# EasyEDA Pro project Knight_Rider.eprj

# Schematic Schematic1
Board Name: Board1; Create Date: 2026-06-02; Page Name: P1; Project Name: Knight_Rider; Schematic Name: Schematic1; Update Date: 2026-06-06; Company: EasyEDA.com; Page Size: A4; Version: V1.0
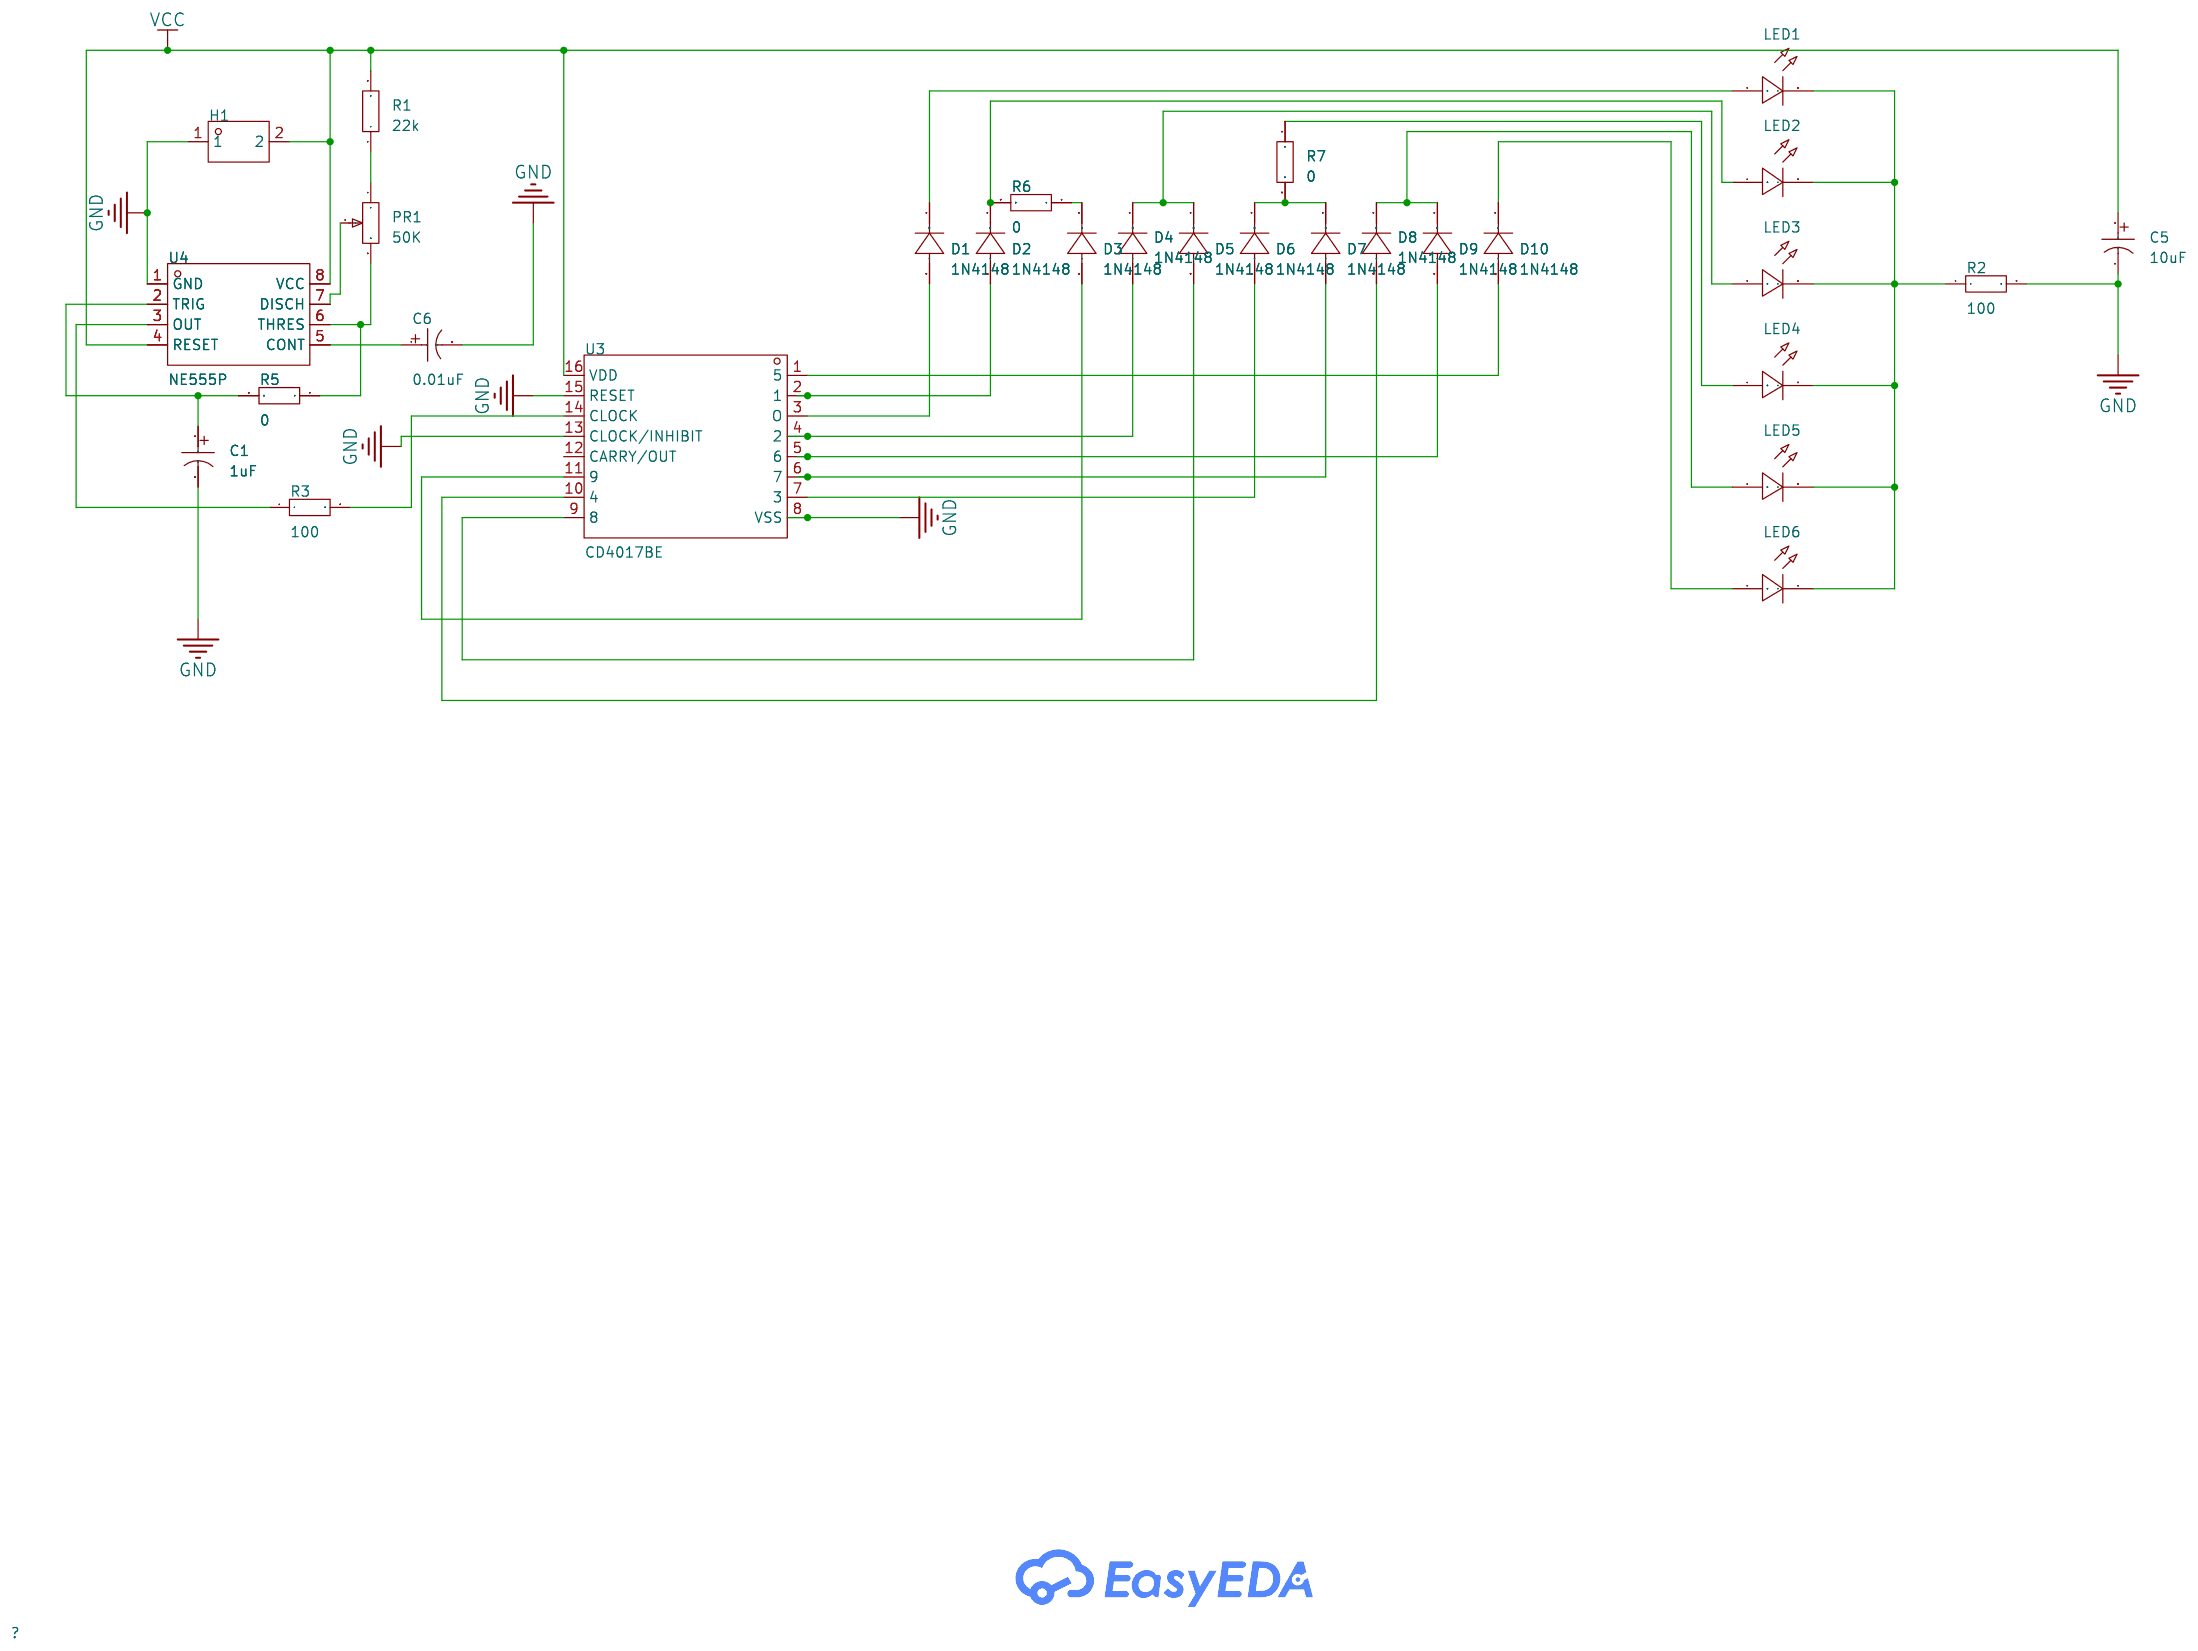
[diagram p0: schematic sheet]

## Parts
C1  1uF  [CAP-TH_BD6.3-P2.50-D1.0-FD]
C5  10uF  [CAP-TH_BD6.3-P2.50-D1.0-FD]
C6  0.01uF  [CAP-TH_BD6.3-P2.50-D1.0-FD]
D1  1N4148  [DO-35_BD1.7-L3.6-P10.00-D0.5-RD]
D2  1N4148  [DO-35_BD1.7-L3.6-P10.00-D0.5-RD]
D3  1N4148  [DO-35_BD1.7-L3.6-P10.00-D0.5-RD]
D4  1N4148  [DO-35_BD1.7-L3.6-P10.00-D0.5-RD]
D5  1N4148  [DO-35_BD1.7-L3.6-P10.00-D0.5-RD]
D6  1N4148  [DO-35_BD1.7-L3.6-P10.00-D0.5-RD]
D7  1N4148  [DO-35_BD1.7-L3.6-P10.00-D0.5-RD]
D8  1N4148  [DO-35_BD1.7-L3.6-P10.00-D0.5-RD]
D9  1N4148  [DO-35_BD1.7-L3.6-P10.00-D0.5-RD]
D10  1N4148  [DO-35_BD1.7-L3.6-P10.00-D0.5-RD]
H1  -  [HDR-TH_2P-P2.54-V-M-2]
LED1  -  [LED-TH_BD3.0-P2.54-FD]
LED2  -  [LED-TH_BD3.0-P2.54-FD]
LED3  -  [LED-TH_BD3.0-P2.54-FD]
LED4  -  [LED-TH_BD3.0-P2.54-FD]
LED5  -  [LED-TH_BD3.0-P2.54-FD]
LED6  -  [LED-TH_BD3.0-P2.54-FD]
PR1  50K  [RES-ADJ-TH_3P-L9.5-W9.5-P2.54-BR-BS]
R1  22k  [RES-TH_BD1.8-L3.2-P7.20-D0.4]
R2  100  [RES-TH_BD1.8-L3.2-P7.20-D0.4]
R3  100  [RES-TH_BD1.8-L3.2-P7.20-D0.4]
R5  0  [RES-TH_BD1.8-L3.2-P7.20-D0.4]
R6  0  [RES-TH_BD1.8-L3.2-P7.20-D0.4]
R7  0  [RES-TH_BD1.8-L3.2-P7.20-D0.4]
U3  CD4017BE  [DIP-16_16P-L20.2-W6.6-P2.54-LS7.6-BL]
U4  NE555P  [DIP-8_L9.8-W6.6-P2.54-LS7.6-BL]

## Library data of the parts
C1 C5 C6 = KS227M016E07RR0VH2FP0: LCSC Part Name: 220uF ±20% 16V; Supplier Part: C43340; Manufacturer: Chengx(承兴); Supplier Footprint: 插件,D6.3xL7mm; JLCPCB Part Class: Extended Part; Datasheet: https://item.szlcsc.com/datasheet/KS227M016E07RR0VH2FP0/44331.html; Supplier: LCSC; Tolerance: ±20%; Voltage Rating: 16V; Pin Spacing: 2.5mm; Diameter: 6.3mm; Height - Seated (Max): 7mm; Lifetime: 1000hrs@105℃; Operating Temperature: -40℃~+105℃
D1-D10 = 1N4148_C22434654: Supplier Part: C22434654; Manufacturer: DIOTEC(德欧泰克); Supplier Footprint: DO-35; JLCPCB Part Class: Extended Part; Datasheet: https://item.szlcsc.com/datasheet/1N4148/24058303.html; Supplier: LCSC; Pd - Power Dissipation: 500mW; Current - Rectified: 200mA; Voltage - DC Reverse(Vr): 75V; Voltage - Forward(Vf@If): 1V@10mA; Reverse Leakage Current (Ir): 5uA@75V; Operating Junction Temperature Range: -50℃~+175℃
H1 = HDR-M_2.54_2x1: Supplier Footprint: Through
LED1-LED6 = LED_TH-R_3mm: Supplier Footprint: Through
PR1 = R_3386P: Supplier Footprint: Through
R1-R3 R5-R7 = Res_AXIAL-1/8W: Supplier Footprint: Through
U3 = CD4017BE_C34519: LCSC Part Name: 5.5MHz 10位十进制计数器; Supplier Part: C34519; Manufacturer: TI(德州仪器); Supplier Footprint: DIP-16; JLCPCB Part Class: Extended Part; Datasheet: https://www.ti.com/cn/lit/gpn/cd4017b; Supplier: LCSC; Logic Type: Divide-by-10; Direction: Up Counter; Voltage - Supply: 3V~18V; Number of Elements: 1; Trigger Type: Rising Edge; Reset: Asynchronous; Timing: Synchronous; Count Rate: 5.5MHz; Operating Temperature: -55℃~+125℃; Propagation Delay: 135ns; Features: Reset function；Cascade counter；Static operation
U4 = NE555P: LCSC Part Name: 555精密定时器; Supplier Part: C46749; Manufacturer: TI(德州仪器); Supplier Footprint: DIP-8; JLCPCB Part Class: Extended Part; Datasheet: https://www.ti.com/cn/lit/gpn/ne555; Supplier: LCSC; Timer Number: 1; Voltage - Supply: 4.5V~16V; Output Current: 200mA; Supply Current: 2mA; Operating Temperature: 0℃~+70℃; Features: 占空比可调振荡；复位功能

## Nets
GND: C1.2 C5.2 C6.2 H1.1 R2.2 U3.8(VSS) U3.13(CLOCK/INHIBIT) U3.15(RESET) U4.1(GND)
VCC: C5.1 H1.2 R1.2 U3.16(VDD) U4.4(RESET) U4.8(VCC)
$1N2038: D1.2(A) U3.3(O)
$1N2046: D2.2(A) U3.2(1)
$1N2052: D3.2(A) U3.11(9)
$1N2063: D4.2(A) U3.4(2)
$1N2071: D5.2(A) U3.9(8)
$1N2086: D6.2(A) U3.7(3)
$1N2096: D8.2(A) U3.10(4)
$1N2109: D9.2(A) U3.5(6)
$1N2117: D10.2(A) U3.1(5)
$1N2219: D8.1(C) D9.1(C) LED5.1(C)
$1N2258: D10.1(C) LED6.1(C)
$1N2754: LED1.2(A) LED2.2(A) LED3.2(A) LED4.2(A) LED5.2(A) LED6.2(A) R2.1
$1N3011: C6.1 U4.5(CONT)
$1N3091: PR1.1 R1.1
$1N3125: PR1.2 U4.7(DISCH)
$1N3131: R3.1 U4.3(OUT)
$1N3149: R3.2 U3.14(CLOCK)
$1N3745: D1.1(C) LED1.1(C)
$1N4406: D7.2(A) U3.6(7)
$1N4518: C1.1 R5.2 U4.2(TRIG)
$1N4603: PR1.3 R5.1 U4.6(THRES)
$1N4871: D3.1(C) R6.1
$1N4876: D2.1(C) LED2.1(C) R6.2
$1N4926: D4.1(C) D5.1(C) LED3.1(C)
$1N4944: LED4.1(C) R7.1
$1N4948: D6.1(C) D7.1(C) R7.2

Not connected (* = marked no-connect by the designer): U3 12(CARRY/OUT)

# Board PCB1
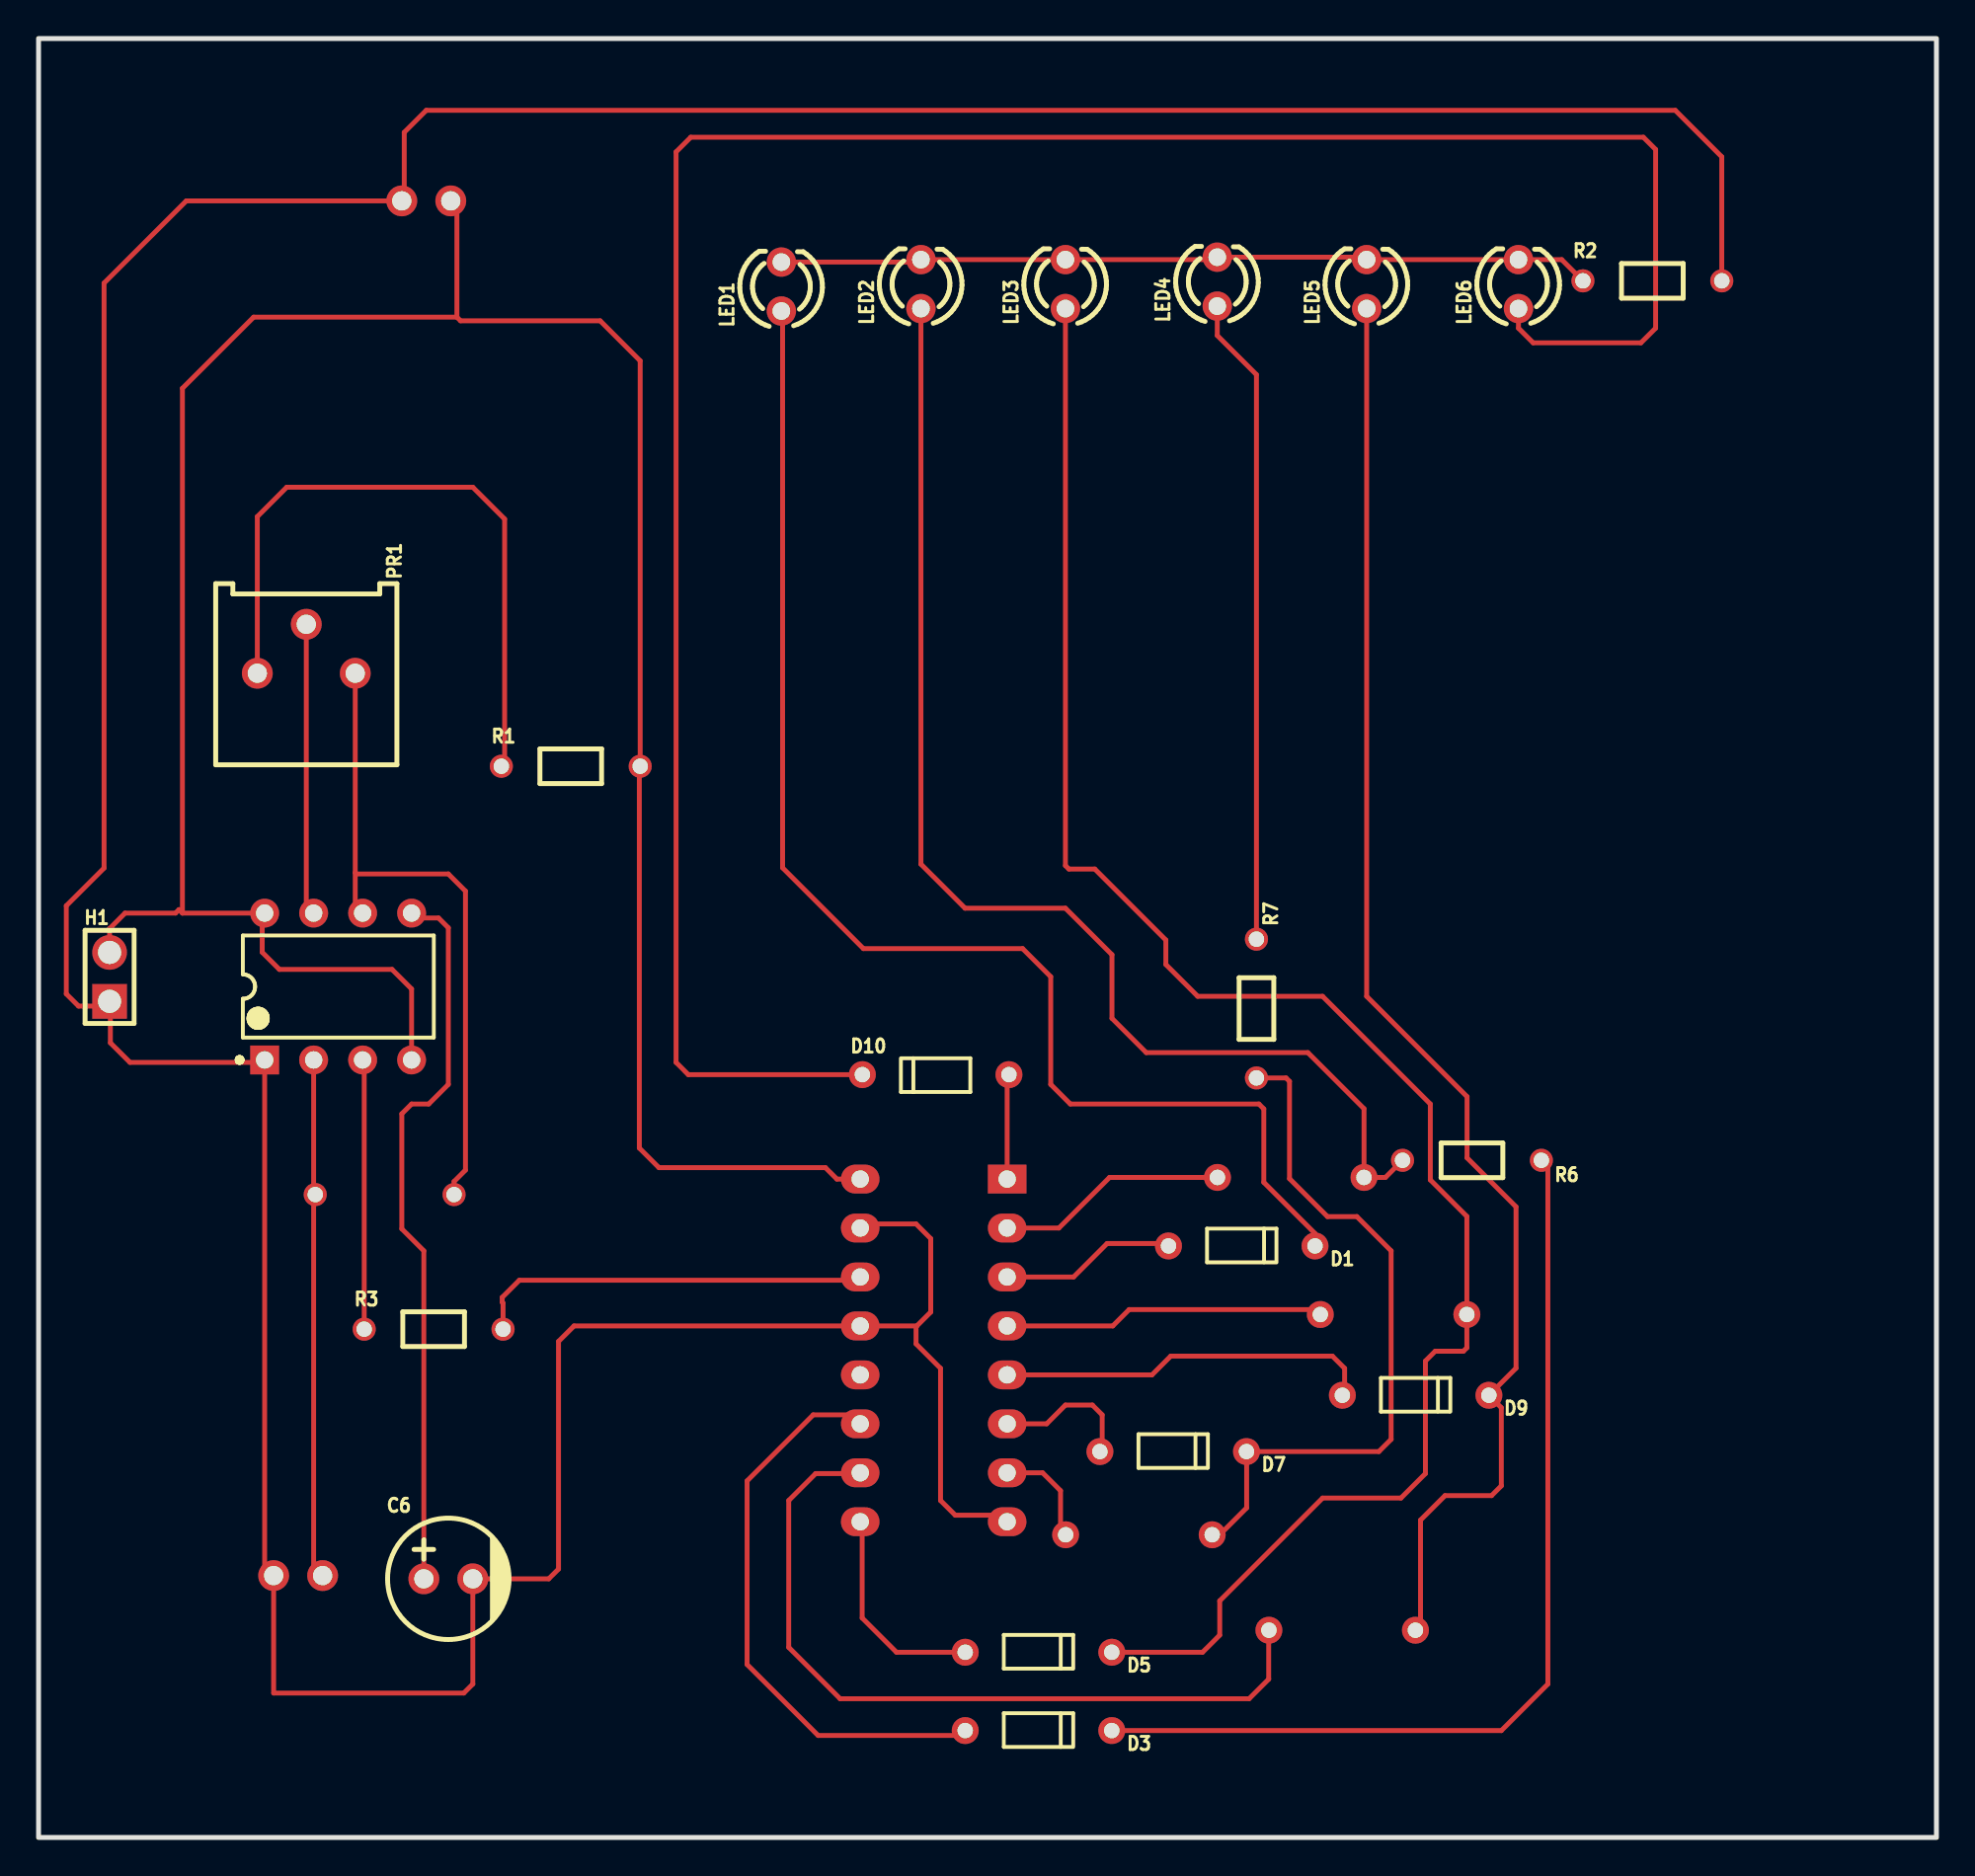
[diagram p1: board, top side]
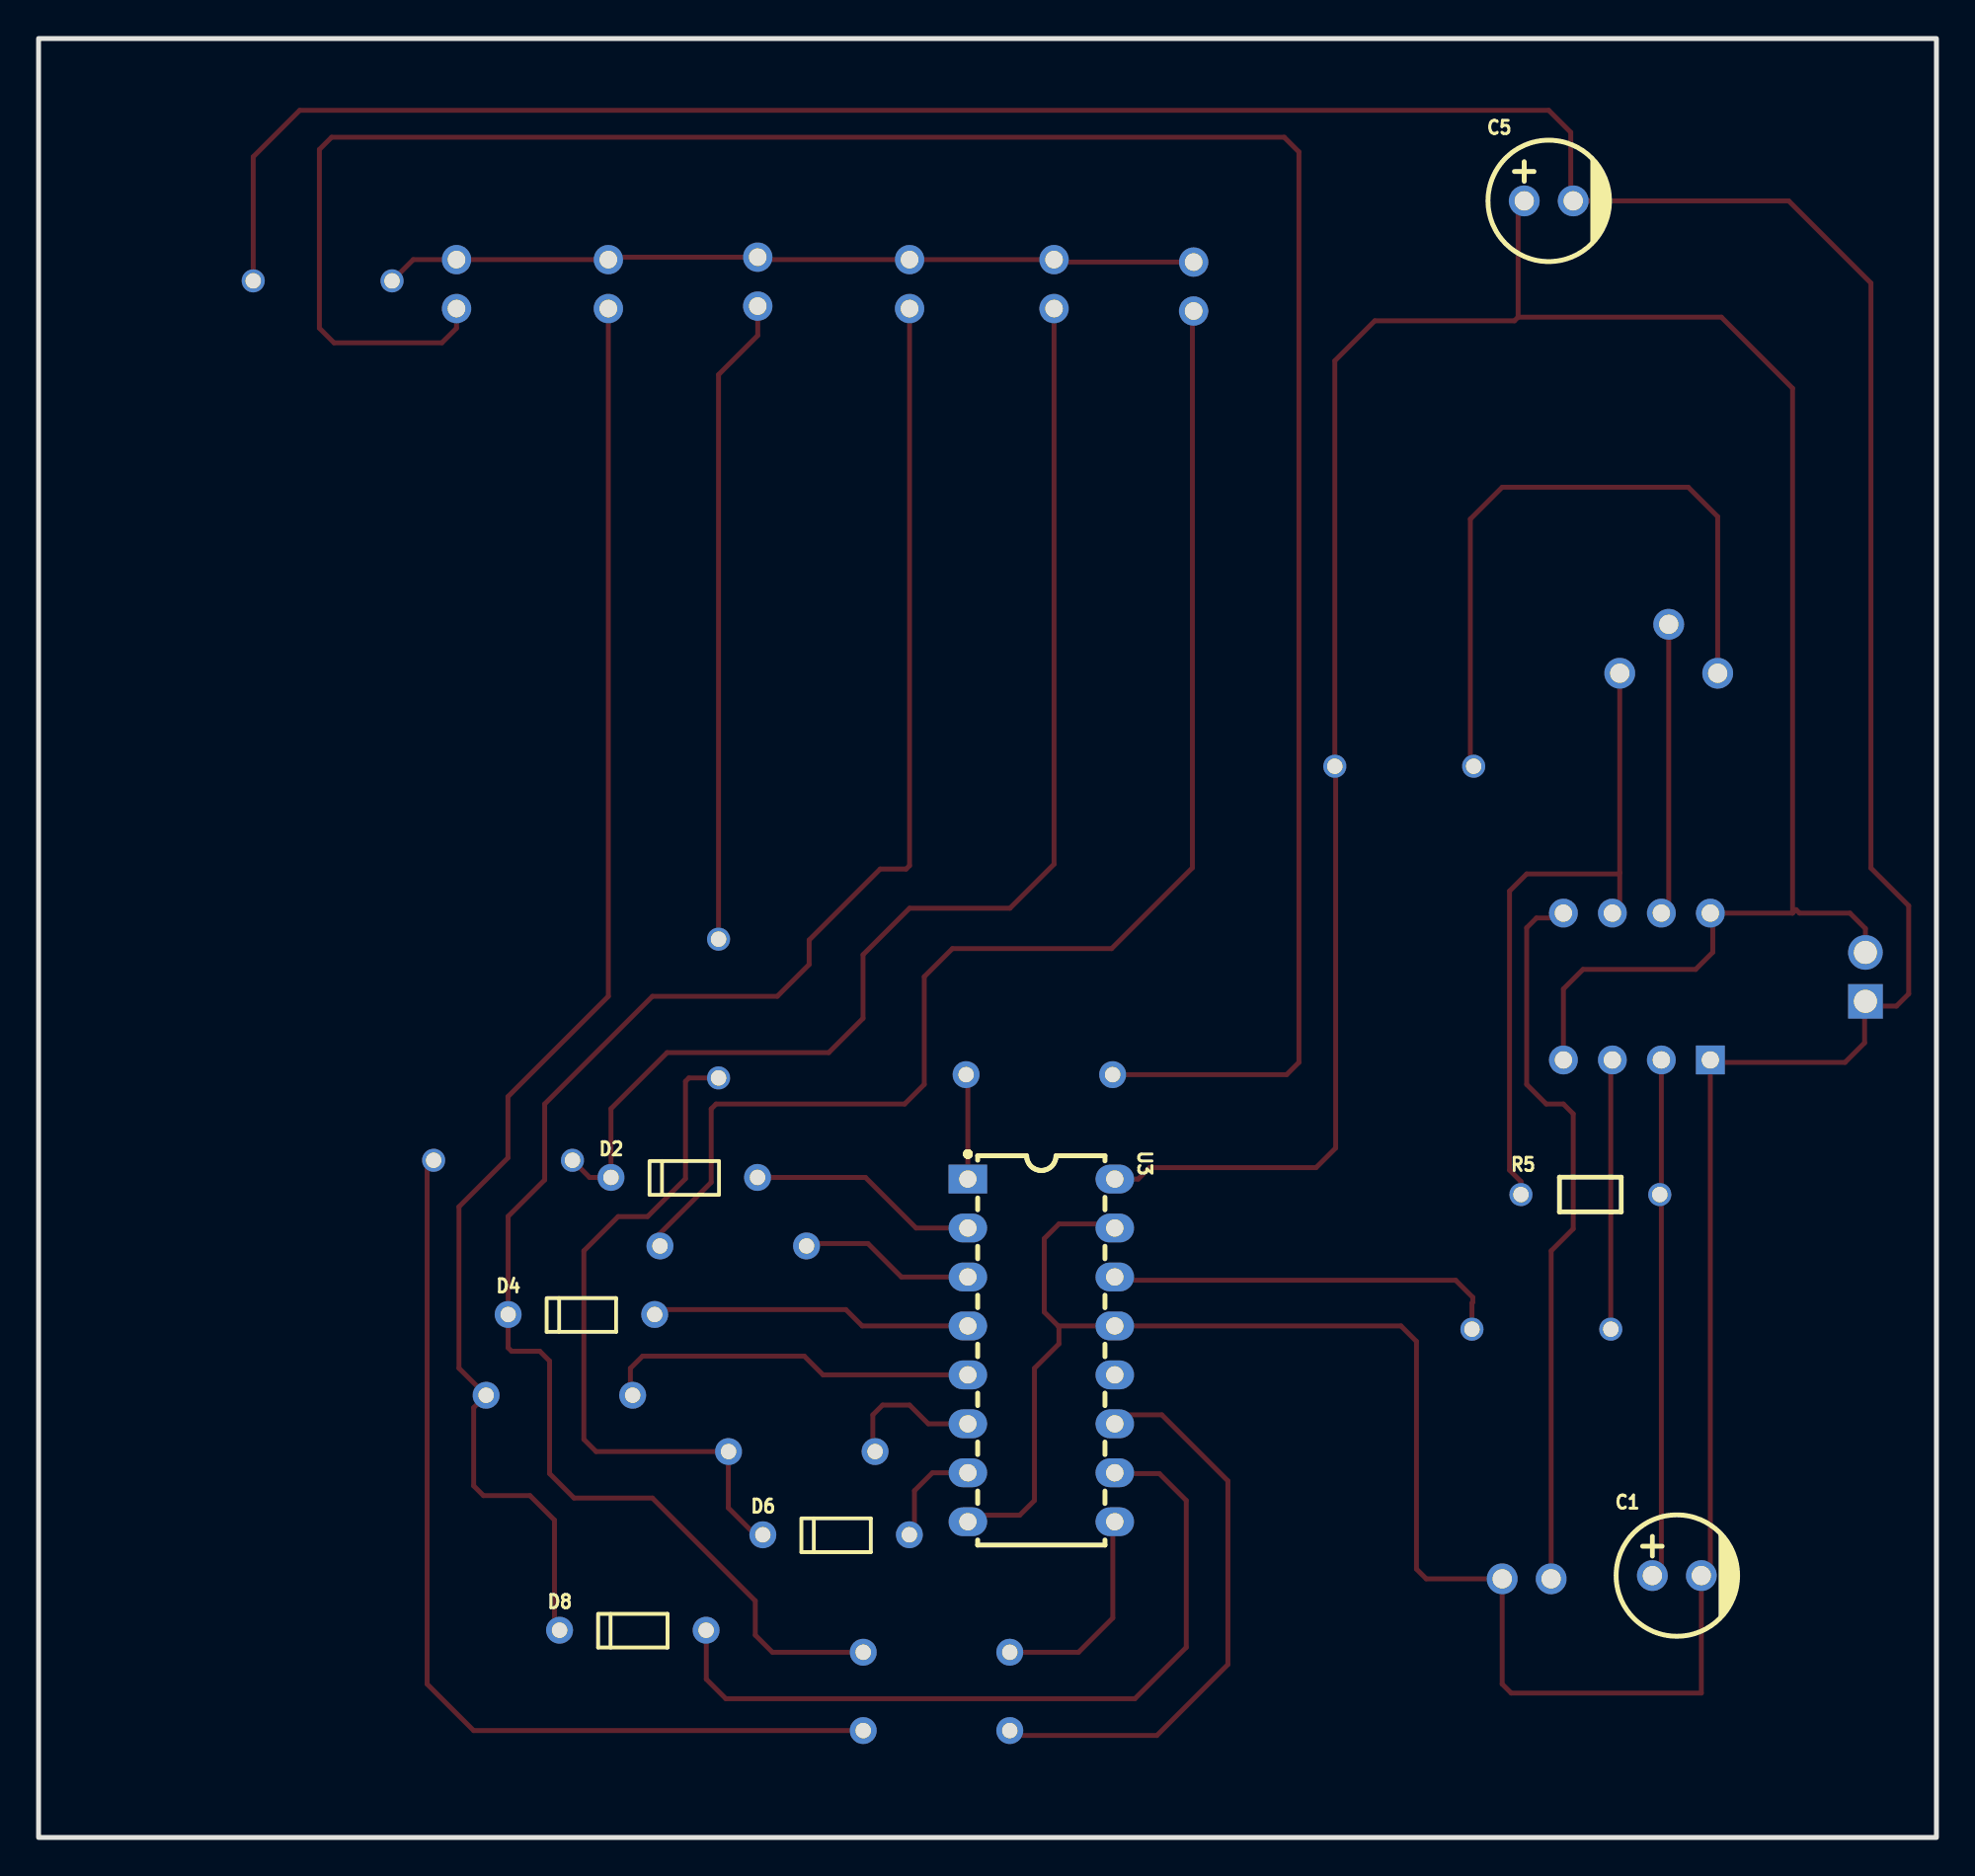
[diagram p2: board, bottom side, seen from below]

Outline 98.42 x 93.35 mm; copper layers: Top Layer, Bottom Layer. Coordinates in mm from the lower left corner of the outline.
Outline path: rectangle 0,93.35 98.42,0
Stack: Top Layer 0.035mm / Dielectric1 1.51mm FR4 er 4.5 / Bottom Layer 0.035mm

## Design rules (mm)
template: JLCPCB Capability(Two Layers Board)
spacing copperThickness1oz (default): track to track 0.102, other pairs 0.152 to 0.3
spacing copperThickness2oz: track to track 0.203, other pairs 0.152 to 0.3
track width copperThickness1oz (default): min 0.127, default 0.254, max 2.54
track width copperThickness2oz: min 0.203, default 0.254, max 2.54
differential pair differentialPair (default): width min 0.127, default 0.254, max 2.54; gap min 0.152, default 0.152
via viaSize (default): diameter min 0.5, default 0.61, max 10; hole min 0.3, default 0.305, max 6.3

## Placement (name value [footprint] x y rotation side)
C1  1uF  [CAP-TH_BD6.3-P2.50-D1.0-FD]  13.46 13.59 180 bottom
C5  10uF  [CAP-TH_BD6.3-P2.50-D1.0-FD]  20.11 84.92 180 bottom
C6  0.01uF  [CAP-TH_BD6.3-P2.50-D1.0-FD]  21.25 13.42 0 top
D1  1N4148  [DO-35_BD1.7-L3.6-P10.00-D0.5-RD]  62.4 30.69 180 top
D2  1N4148  [DO-35_BD1.7-L3.6-P10.00-D0.5-RD]  64.94 34.25 180 bottom
D3  1N4148  [DO-35_BD1.7-L3.6-P10.00-D0.5-RD]  51.86 5.55 180 top
D4  1N4148  [DO-35_BD1.7-L3.6-P10.00-D0.5-RD]  70.27 27.14 180 bottom
D5  1N4148  [DO-35_BD1.7-L3.6-P10.00-D0.5-RD]  51.86 9.61 180 top
D6  1N4148  [DO-35_BD1.7-L3.6-P10.00-D0.5-RD]  57.06 15.71 180 bottom
D7  1N4148  [DO-35_BD1.7-L3.6-P10.00-D0.5-RD]  58.84 20.02 180 top
D8  1N4148  [DO-35_BD1.7-L3.6-P10.00-D0.5-RD]  67.61 10.75 180 bottom
D9  1N4148  [DO-35_BD1.7-L3.6-P10.00-D0.5-RD]  71.42 22.95 180 top
D10  1N4148  [DO-35_BD1.7-L3.6-P10.00-D0.5-RD]  46.52 39.58 0 top
H1  -  [HDR-TH_2P-P2.54-V-M-2]  3.68 44.66 0 top
LED1  -  [LED-TH_BD3.0-P2.54-FD]  38.52 80.48 90 top
LED2  -  [LED-TH_BD3.0-P2.54-FD]  45.76 80.6 90 top
LED3  -  [LED-TH_BD3.0-P2.54-FD]  53.25 80.6 90 top
LED4  -  [LED-TH_BD3.0-P2.54-FD]  61.13 80.73 90 top
LED5  -  [LED-TH_BD3.0-P2.54-FD]  68.88 80.6 90 top
LED6  -  [LED-TH_BD3.0-P2.54-FD]  76.75 80.6 90 top
PR1  50K  [RES-ADJ-TH_3P-L9.5-W9.5-P2.54-BR-BS]  13.88 61.68 270 top
R1  22k  [RES-TH_BD1.8-L3.2-P7.20-D0.4]  27.6 55.58 0 top
R2  100  [RES-TH_BD1.8-L3.2-P7.20-D0.4]  83.69 80.77 0 top
R3  100  [RES-TH_BD1.8-L3.2-P7.20-D0.4]  20.49 26.37 0 top
R5  0  [RES-TH_BD1.8-L3.2-P7.20-D0.4]  17.95 33.36 180 bottom
R6  0  [RES-TH_BD1.8-L3.2-P7.20-D0.4]  74.34 35.14 180 top
R7  0  [RES-TH_BD1.8-L3.2-P7.20-D0.4]  63.16 43.01 270 top
U3  CD4017BE  [DIP-16_16P-L20.2-W6.6-P2.54-LS7.6-BL]  46.42 25.27 270 bottom
U4  NE555P  [DIP-8_L9.8-W6.6-P2.54-LS7.6-BL]  15.54 44.15 0 top

## Footprints (pads in the part's own frame, mm; a bottom-side part is the same pattern mirrored in y, then rotated)
CAP-TH_BD6.3-P2.50-D1.0-FD
  round 1.6 hole 1: 1(-1.27,0) 2(1.27,0)
DIP-8_L9.8-W6.6-P2.54-LS7.6-BL
  rect 1.5x1.5 hole 0.9: 1(-3.81,-3.81)
  round 1.5 hole 0.9: 2(-1.27,-3.81) 3(1.27,-3.81) 4(3.81,-3.81) 5(3.81,3.81) 6(1.27,3.81) 7(-1.27,3.81) 8(-3.81,3.81)
DIP-16_16P-L20.2-W6.6-P2.54-LS7.6-BL
  rect 1.5x2 hole 0.9: 1(-8.89,-3.81)
  oval 1.5x2 hole 0.9: 2(-6.35,-3.81) 3(-3.81,-3.81) 4(-1.27,-3.81) 5(1.27,-3.81) 6(3.81,-3.81) 7(6.35,-3.81) 8(8.89,-3.81) 9(8.89,3.81) 10(6.35,3.81) 11(3.81,3.81) 12(1.27,3.81) 13(-1.27,3.81) 14(-3.81,3.81) 15(-6.35,3.81) 16(-8.89,3.81)
DO-35_BD1.7-L3.6-P10.00-D0.5-RD
  round 1.4 hole 0.8: 1(-3.8,0) 2(3.8,0)
HDR-TH_2P-P2.54-V-M-2
  rect 1.8x1.8 hole 1.2: 1(0,-1.27)
  round 1.8 hole 1.2: 2(0,1.27)
LED-TH_BD3.0-P2.54-FD
  round 1.524 hole 0.914: 1(-1.27,0) 2(1.27,0)
RES-ADJ-TH_3P-L9.5-W9.5-P2.54-BR-BS
  round 1.6 hole 1: 1(1.27,-2.54) 2(-1.27,0) 3(1.27,2.54)
RES-TH_BD1.8-L3.2-P7.20-D0.4
  round 1.2 hole 0.8: 1(-3.6,0) 2(3.6,0)

## Nets
As in the schematic.

Pads without a net: U3 12

## Routing (per net, layer and track width the routed paths; a pad name or vN(x,y) marks a point on that pad's centre or on a via; arc(x,y) is an arc through that point)
GND: length 254.8
  Top Layer w0.254: 45.55,26.54 45.51,26.5 45.51,25.61 46.78,24.34 46.78,17.48 47.54,16.72 49.89,16.72 U3.8 ; 45.55,26.54 46.27,27.26 46.27,31.07 45.51,31.84 42.82,31.84 U3.15 ; 45.55,26.54 U3.13 27.77,26.54 26.97,25.74 26.97,13.93 26.46,13.42 C6.2 22.52,7.96 22.05,7.49 12.19,7.49 C1.2 11.73,14.06 U4.1 11.6,40.22 4.74,40.22 3.72,41.23 3.72,43.34 H1.1 3.44,43.14 2.07,43.14 1.44,43.77 1.44,48.35 3.4,50.3 3.4,80.66 7.66,84.92 C5.2 18.96,85.05 18.96,88.48 20.11,89.62 84.88,89.62 ; R2.2 87.29,87.21 84.88,89.62
VCC: length 136.7
  Top Layer w0.254: 21.7,78.89 21.7,84.6 C5.1 ; 21.7,78.89 11.15,78.89 7.46,75.2 7.46,47.96 ; 21.7,78.89 21.89,78.7 29.12,78.7 31.2,76.62 R1.2 31.16,55.54 31.16,35.77 32.17,34.76 40.81,34.76 41.4,34.16 U3.16 ; 7.46,47.96 U4.8 11.6,47.84 11.6,45.93 12.49,45.04 18.33,45.04 19.35,44.03 U4.4 ; 7.46,47.96 7.28,48.14 7.1,47.96 4.49,47.96 3.68,47.16 H1.2
$1N2038: length 9.1
  Top Layer w0.254: D1.2 58.47,30.82 55.41,30.82 53.68,29.08 U3.3
$1N2046: length 12
  Top Layer w0.254: U3.2 52.92,31.62 55.54,34.25 D2.2
$1N2052: length 29.9
  Top Layer w0.254: D3.2 47.8,5.29 40.43,5.29 36.74,8.98 36.74,18.5 40.17,21.93 42.14,21.93 U3.11
$1N2063: length 16.7
  Top Layer w0.254: U3.4 55.71,26.54 56.56,27.39 66.22,27.39 D4.2
$1N2071: length 11.1
  Top Layer w0.254: D5.2 44.49,9.61 42.71,11.39 42.71,16.28 U3.9
$1N2086: length 5.5
  Top Layer w0.254: D6.2 53,15.97 53,17.99 52.07,18.92 U3.7
$1N2096: length 40.9
  Top Layer w0.254: U3.10 42.57,18.88 40.3,18.88 38.9,17.48 38.9,9.86 41.57,7.2 62.78,7.2 63.8,8.21 63.8,10.74 D8.2
$1N2109: length 19.6
  Top Layer w0.254: U3.5 57.74,24 58.72,24.98 67.1,24.98 67.73,24.34 67.73,23.06 D9.2
$1N2117: length 5.5
  Top Layer w0.254: D10.2 50.23,39.49 U3.1
$1N2219: length 75.9
  Top Layer w0.254: LED5.1 68.88,43.65 74.08,38.44 74.08,35.26 76.62,32.72 76.62,24.35 D9.1 75.86,22.3 75.86,18.25 75.35,17.74 72.94,17.74 71.67,16.47 71.67,11.02 71.41,10.75
$1N2258: length 126.6
  Top Layer w0.254: LED6.1 76.75,78.32 77.51,77.56 83.1,77.56 83.86,78.32 83.86,87.59 83.23,88.22 33.82,88.22 33.06,87.46 33.06,40.22 33.7,39.58 D10.1
$1N2754: length 42.2
  Top Layer w0.254: R2.1 78.99,81.87 LED6.2 LED5.2 68.75,82 LED4.2 61,81.87 LED3.2 LED2.2 45.63,81.75 LED1.2
$1N3011: length 38
  Top Layer w0.254: U4.5 19.6,47.71 20.74,47.71 21.25,47.2 21.25,39.07 20.23,38.06 19.35,38.06 18.84,37.55 18.84,31.58 19.98,30.44 C6.1
$1N3091: length 35.2
  Top Layer w0.254: R1.1 24.17,55.76 24.17,68.41 22.52,70.06 12.87,70.06 11.34,68.54 PR1.1
$1N3125: length 15.1
  Top Layer w0.254: PR1.2 13.88,48.35 U4.7
$1N3131: length 14
  Top Layer w0.254: U4.3 16.89,40.26 R3.1
$1N3149: length 20.7
  Top Layer w0.254: R3.2 24.09,27.73 24.04,27.77 24.04,28.03 24.93,28.91 42.44,28.91 U3.14
$1N3745: length 70.5
  Top Layer w0.254: LED1.1 38.59,79.14 38.59,50.31 42.78,46.12 51.03,46.12 52.49,44.66 52.49,39.07 53.51,38.06 63.29,38.06 63.54,37.8 63.54,33.99 66.2,31.34 D1.1
$1N4406: length 7.5
  Top Layer w0.254: D7.2 55.16,20.14 55.16,21.93 54.65,22.44 53.25,22.44 52.28,21.46 U3.6
$1N4518: length 26.9
  Top Layer w0.254: C1.1 14.27,14.06 U4.2
$1N4603: length 34.7
  Top Layer w0.254: PR1.3 16.42,50.06 ; 16.42,50.06 16.42,48.35 U4.6 ; 16.42,50.06 16.49,50 21.25,50 22.14,49.11 22.14,34.63 21.55,34.04 R5.1
$1N4871: length 50.9
  Top Layer w0.254: 55.66,5.55 75.86,5.55 78.27,7.96 78.27,34.8 R6.1
$1N4876: length 64.9
  Top Layer w0.254: R6.2 69.85,34.25 D2.1 68.74,37.81 65.83,40.73 57.45,40.73 55.67,42.5 55.67,45.81 53.25,48.22 48.05,48.22 45.76,50.5 LED2.1
$1N4926: length 96.6
  Top Layer w0.254: 55.66,9.61 60.37,9.61 61.26,10.5 61.26,12.28 66.59,17.61 70.65,17.61 71.92,18.88 71.92,24.72 72.43,25.23 73.89,25.23 74.07,25.41 D4.1 74.07,32.23 72.18,34.12 72.18,38.06 66.59,43.65 60.11,43.65 58.46,45.3 58.46,46.57 54.78,50.25 53.43,50.25 53.25,50.43 LED3.1
$1N4944: length 33.7
  Top Layer w0.254: LED4.1 61.13,77.94 63.16,75.9 R7.1
$1N4948: length 36.5
  Top Layer w0.254: R7.2 64.7,39.41 64.88,39.23 64.88,34.19 66.84,32.22 68.37,32.22 70.15,30.44 70.15,20.66 69.51,20.02 D7.1 62.65,20.01 62.65,17.1 61.26,15.71 D6.1
